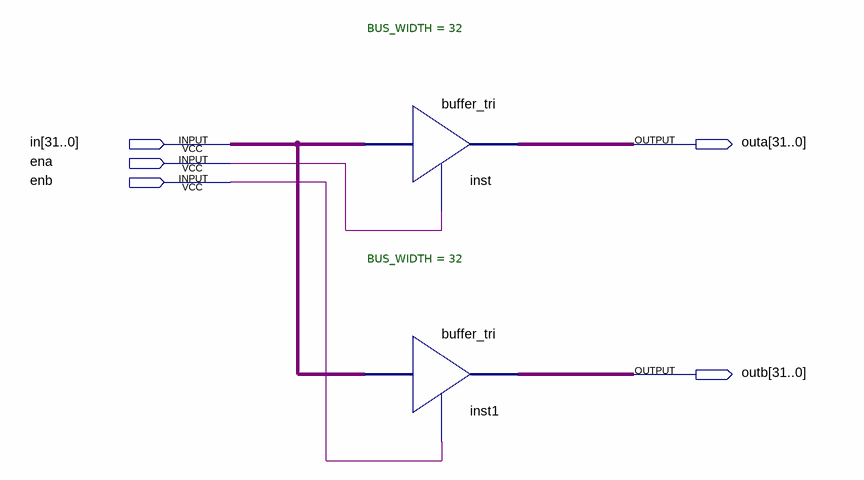
[diagram p0: schematic sheet]
// Quartus schematic bus_switch.bdf as structural Verilog: 2 symbols, 5 pins
module bus_switch (
  input  [31:0] in,
  input  ena,
  input  enb,
  output [31:0] outa,
  output [31:0] outb
);

  buffer_tri #(.BUS_WIDTH(32)) inst (.in(in), .en(ena), .out(outa));
  buffer_tri #(.BUS_WIDTH(32)) inst1 (.in(in), .en(enb), .out(outb));
endmodule
